# EAGLE design Regulator (EAGLE 7.1.0)
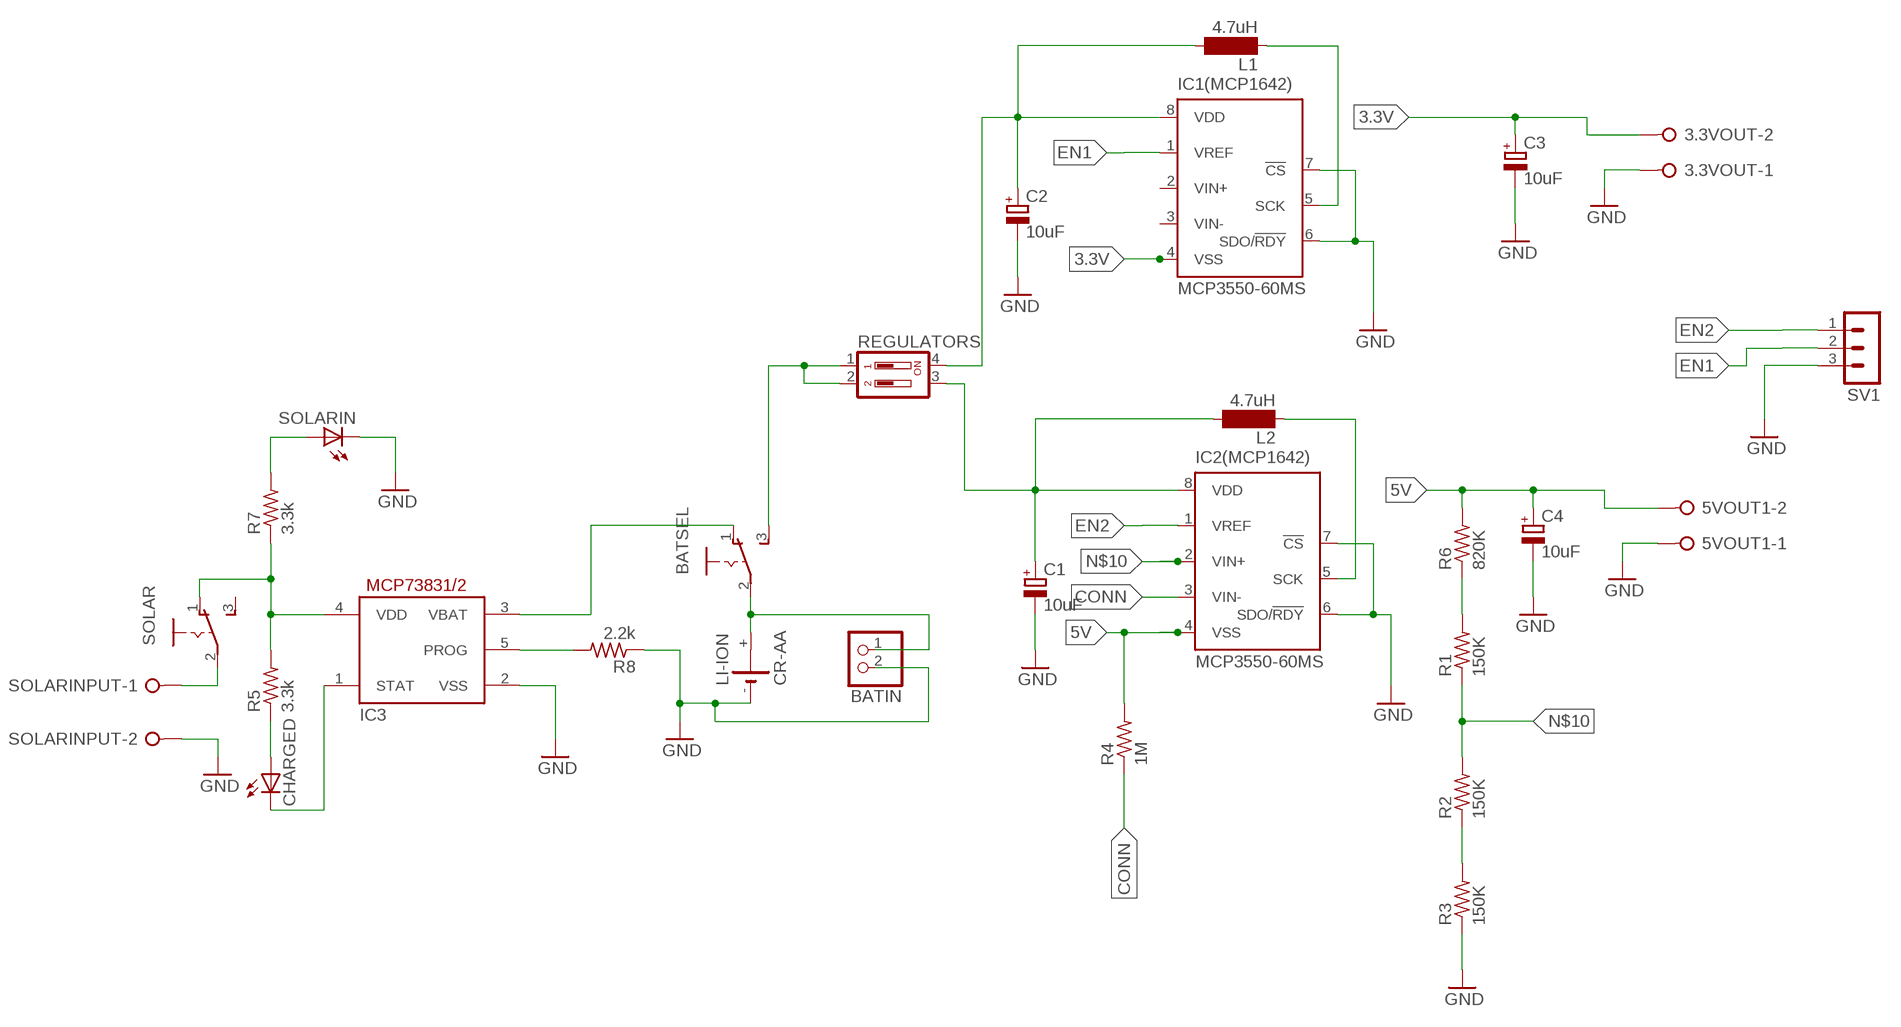
[diagram p0: schematic, sheet 1]

## Parts
3.3VOUT  W237-02P  [W237-132]
5VOUT1  W237-02P  [W237-132]
BATIN  JST_2PIN-THM  [JST-PH-2-THM]
BATSEL  255SB  [255SB]
C1  10uF  CPOL-EU140CLH-1010  [140CLH-1010]
C2  10uF  CPOL-EU140CLH-1010  [140CLH-1010]
C3  10uF  CPOL-EU140CLH-1010  [140CLH-1010]
C4  10uF  CPOL-EU140CLH-1010  [140CLH-1010]
CHARGED  LEDCHIP-LED0603  [CHIP-LED0603]
IC1(MCP1642)  MCP3550-60MS  [MSOP8]
IC2(MCP1642)  MCP3550-60MS  [MSOP8]
IC3  MCP73831/OT  [SOT23-5L]
L1  4.7uH  MS85  [MS85]
L2  4.7uH  MS85  [MS85]
LI-ION  CR-AA  [CRAA]
R1  150K  R-US_M0805  [M0805]
R2  150K  R-US_M0805  [M0805]
R3  150K  R-US_M0805  [M0805]
R4  1M  R-US_M0805  [M0805]
R5  3.3k  R-US_M3216  [M3216]
R6  820K  R-US_M0805  [M0805]
R7  3.3k  R-US_M3216  [M3216]
R8  2.2k  R-US_M3216  [M3216]
REGULATORS  DIP02YL  [DIP02YL]
SOLAR  255SB  [255SB]
SOLARIN  LEDCHIP-LED0603  [CHIP-LED0603]
SOLARINPUT  W237-02P  [W237-132]
SV1  MA03-1  [MA03-1]

## Nets
3.3V: 3.3VOUT.2 C3.+ IC1(MCP1642).4(VSS)
5V: 5VOUT1.2 C4.+ IC2(MCP1642).4(VSS) R4.2 R6.2
CONN: IC2(MCP1642).3(VIN-) R4.1
EN1: IC1(MCP1642).1(VREF) SV1.2
EN2: IC2(MCP1642).1(VREF) SV1.1
MCP1642: C2.+ IC1(MCP1642).8(VDD) L1.2 REGULATORS.4
N$2: IC1(MCP1642).5(SCK) L1.1
N$3: R1.2 R6.1
N$4: IC2(MCP1642).5(SCK) L2.1
N$6: R2.1 R3.2
N$7: C1.+ IC2(MCP1642).8(VDD) L2.2 REGULATORS.3
N$8: IC3.4(VDD) R5.2 R7.1 SOLAR.1(O)
N$10: IC2(MCP1642).2(VIN+) R1.1 R2.2
N$11: CHARGED.A R5.1
N$12: CHARGED.C IC3.1(STAT)
N$13: BATSEL.3(S) REGULATORS.1 REGULATORS.2
N$14: R7.2 SOLARIN.A
N$15: IC3.5(PROG) R8.2
N$16: BATSEL.1(O) IC3.3(VBAT)
N$19: 3.3VOUT.1 5VOUT1.1 BATIN.2 C1.- C2.- C3.- C4.- IC1(MCP1642).6(SDO/!RDY) IC1(MCP1642).7(!CS) IC2(MCP1642).6(SDO/!RDY) IC2(MCP1642).7(!CS) IC3.2(VSS) LI-ION.- R3.1 R8.1 SOLARIN.C SOLARINPUT.2 SV1.3 ; supply symbol labelled GND
N$20: SOLAR.2(P) SOLARINPUT.1
N$22: BATIN.1 BATSEL.2(P) LI-ION.+
Unconnected: IC1(MCP1642).2(VIN+) IC1(MCP1642).3(VIN-) LI-ION.+@1(+) SOLAR.3(S)

## Library data of the parts
3.3VOUT 5VOUT1 SOLARINPUT = con-wago-508:W237-02P: WAGO SREW CLAMP; OC_FARNELL: unknown; OC_NEWARK: unknown
BATIN = adafruit:JST_2PIN: JST 2-Pin Connectors of various flavors SMT-RA (S2B-PH-SM4) 4UConnector #17311 SMT (B2B-PH-SM4) THM-RA (S2B-PH) THM (B2B-PH)
BATSEL SOLAR = switch:255SB: SLIDING SWITCH Distributor Buerklin, 11G810
C1-C4 = rcl:CPOL-EU: POLARIZED CAPACITOR, European symbol
CHARGED SOLARIN = adafruit:LED: LED OSRAM: - CHIPLED LG R971, LG N971, LY N971, LG Q971, LY Q971, LO R971, LY R971 LH N974, LH R974 LS Q976, LO Q976, LY Q976 LO Q996 - Hyper CHIPLED LW Q18S LB Q993, LB Q99A, LB R99A - SideLED LS A670, LO A670, LY A670, LG A670, LP A670 LB A673, LV A673, LT A673, LW A673 LH A674 LY A675 LS A676, LA A676, LO A676, LY A676, LW A676 LS A679, LY A679, LG A679 - Hyper Micro SIDELED® LS Y876, LA Y876, LO Y876, LY Y876 LT Y87S - SmartLED LW L88C, LW L88S LB L89C, LB L89S, LG L890 LS L89K, LO L89K, LY L89K LS L896, LA L896, LO L896, LY L896 - TOPLED LS T670, LO T670, LY T670, LG T670, LP T670 LSG T670, LSP T670, LSY T670, LOP T670, LYG T670 LG T671, LOG T671, LSG T671 LB T673, LV T673, LT T673, LW T673 LH T674 LS T676, LA T676, LO T676, LY T676, LB T676, LH T676, LSB T676, LW T676 LB T67C, LV T67C, LT T67C, LS T67K, LO T67K, LY T67K, LW E67C LS E67B, LA E67B, LO E67B, LY E67B, LB E67C, LV E67C, LT E67C LW T67C LS T679, LY T679, LG T679 LS T770, LO T770, LY T770, LG T770, LP T770 LB T773, LV T773, LT T773, LW T773 LH T774 LS E675, LA E675, LY E675, LS T675 LS T776, LA T776, LO T776, LY T776, LB T776 LHGB T686 LT T68C, LB T68C - Hyper Mini TOPLED® LB M676 - Mini TOPLED Santana® LG M470 LS M47K, LO M47K, LY M47K Source: http://www.osram.convergy.de/
IC1(MCP1642) IC2(MCP1642) = microchip:MCP355*: Low-Power, Single-Channel 22-Bit Delta-Sigma ADCs Source: http://ww1.microchip.com/downloads/en/DeviceDoc/21950c.pdf; MF: MICROCHIP; MPN: MCP3550-60E/MS; OC_FARNELL: 1840933; OC_NEWARK: 69K0134
IC3 = adafruit:MCP73831: MCP73831/2 Miniature Single-Cell, Fully Integrated Li-Ion, Li-Polymer Charge Management Controllers. Nice and small simple lipoly charge controller, with adjustable current and status output (LED) http://www.ladyada.net/library/pcb/eaglelibrary.html
L1 L2 = inductor-neosid:MS85: INDUCTOR SMD power inductor; OC_FARNELL: unknown; OC_NEWARK: unknown
LI-ION = battery:CR-AA: LI BATTERY Varta CRAA-SLF
R1-R8 = adafruit:R-US_: RESISTOR, American symbol
REGULATORS = switch-dil:DIP02YL: DIL/CODE SWITCH; OC_FARNELL: unknown; OC_NEWARK: unknown
SV1 = con-lstb:MA03-1: PIN HEADER; OC_FARNELL: unknown; OC_NEWARK: unknown

## Net classes
0 default: width 0.254 mm, drill 0.508 mm, clearance 0.203 mm

## Board
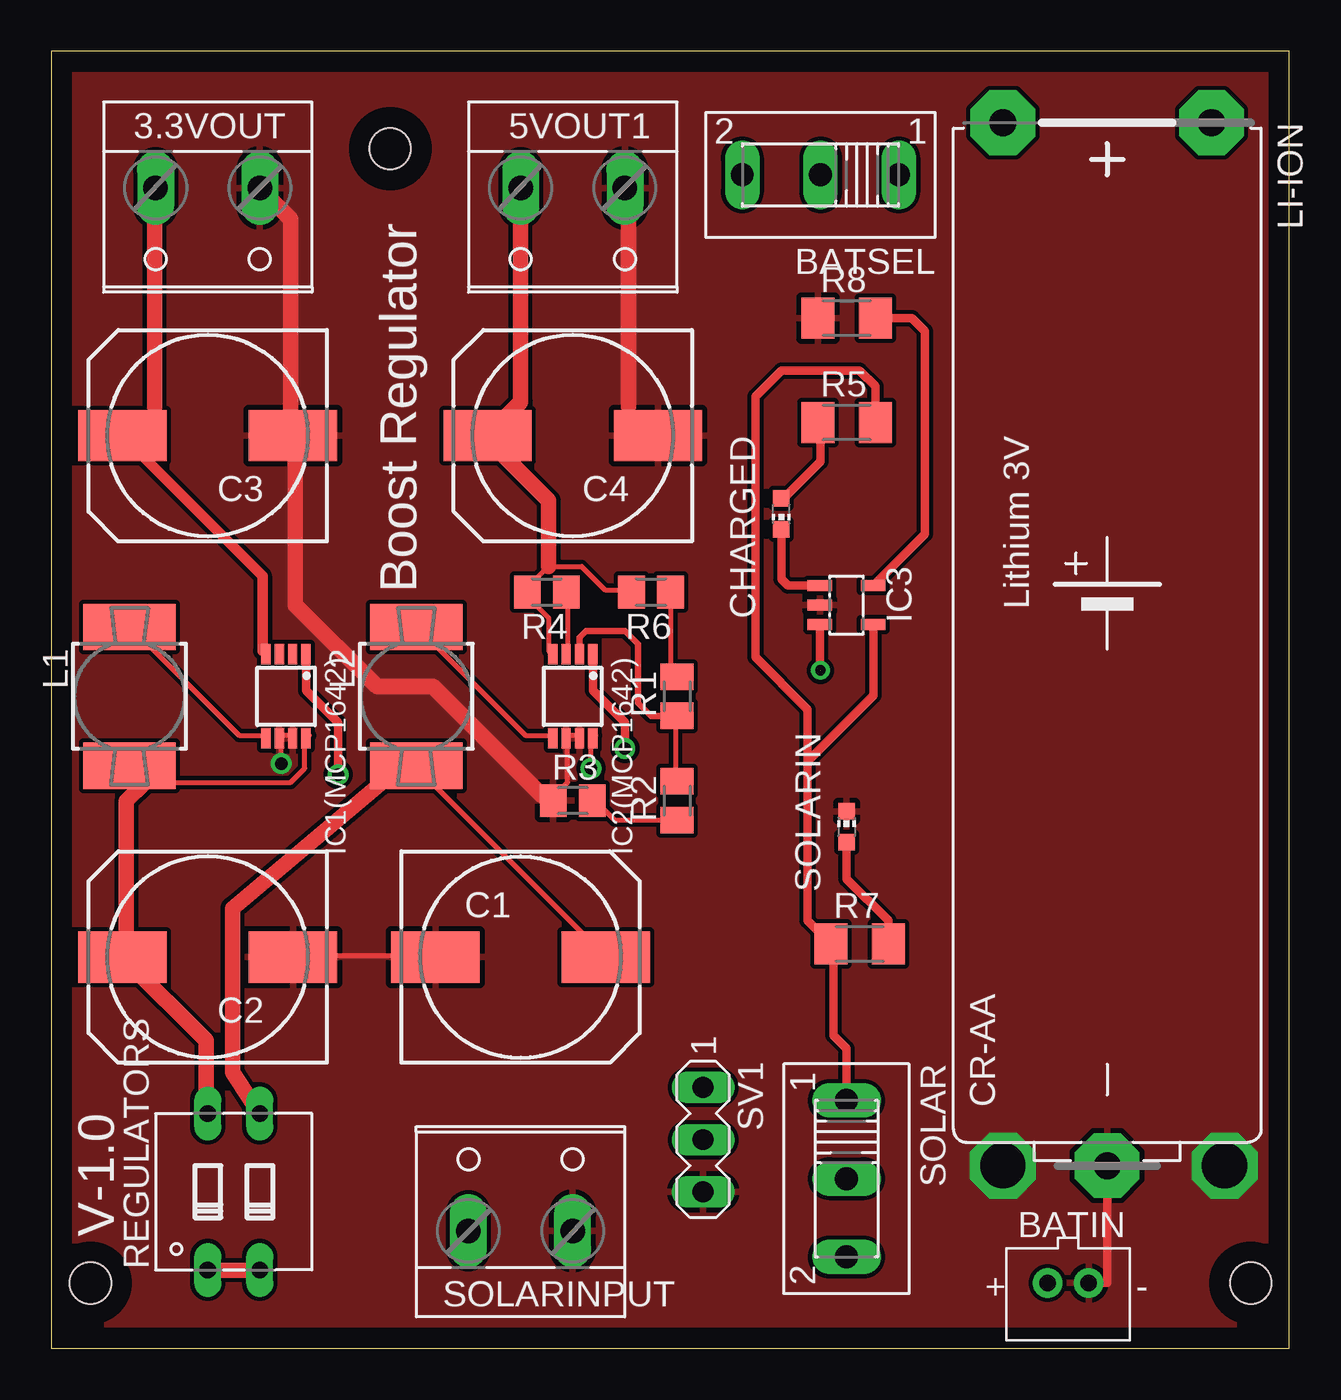
[diagram p1: board, top side]
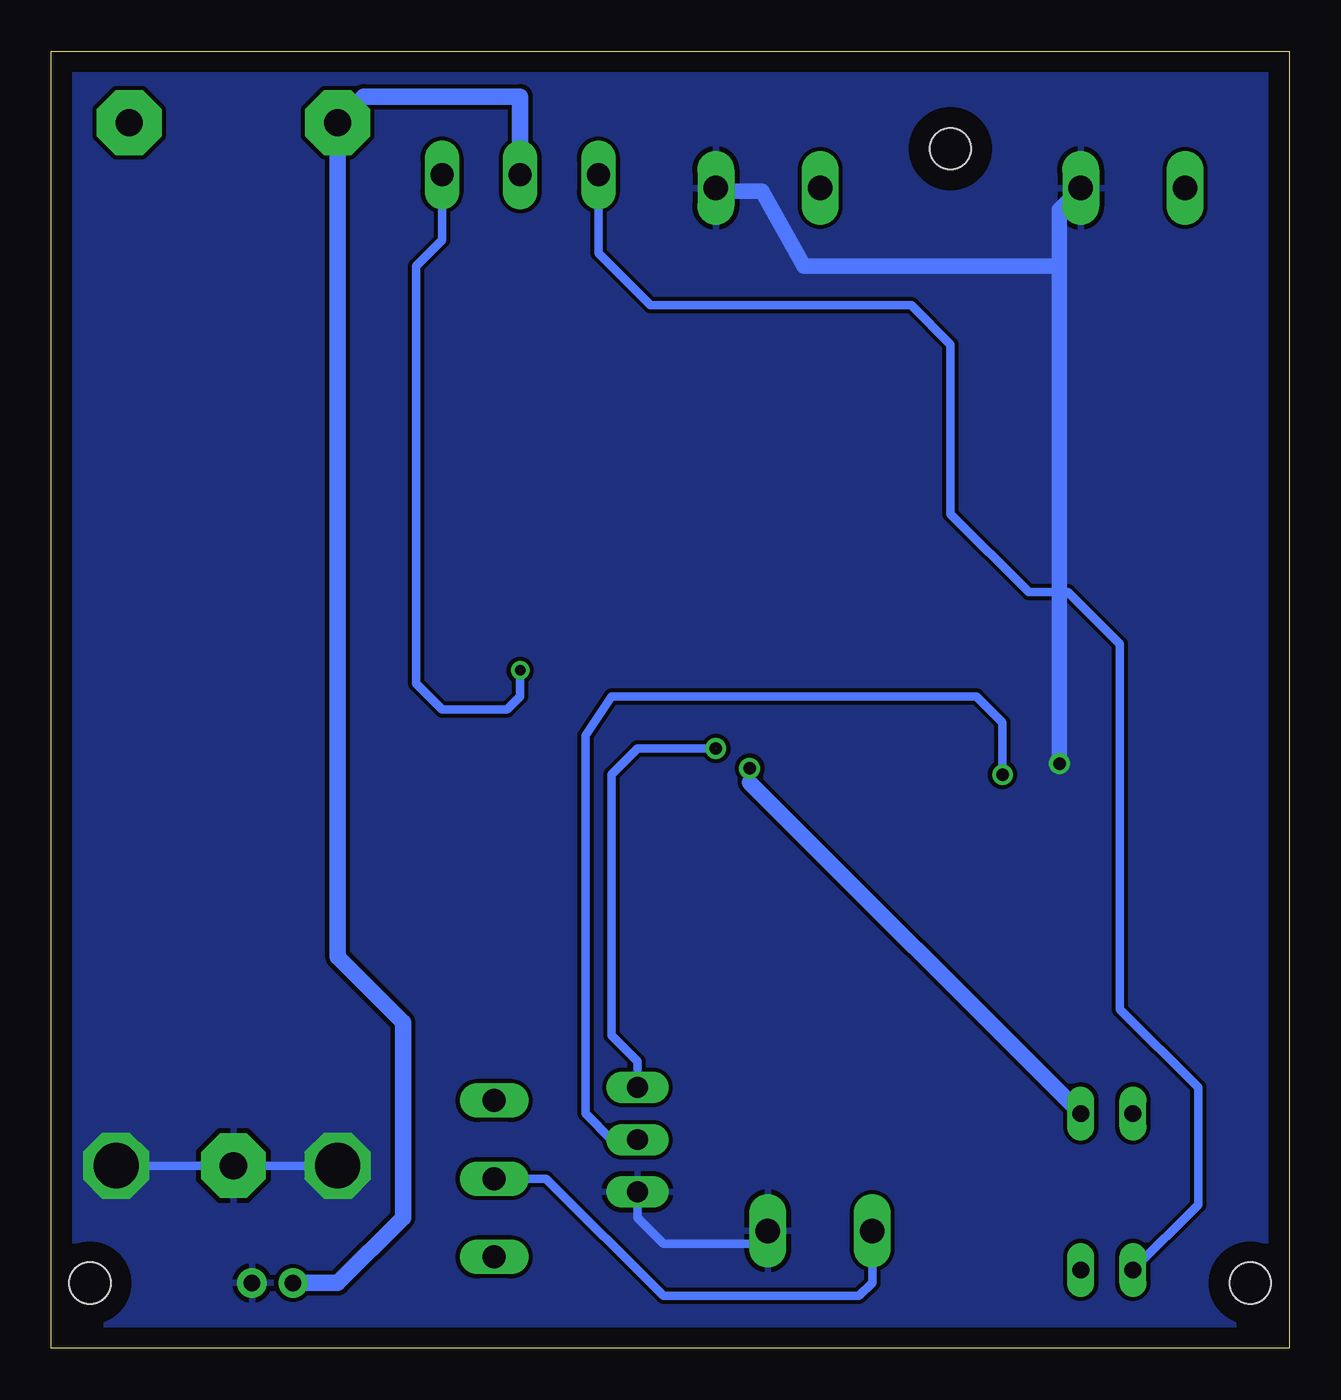
[diagram p2: board, bottom side, seen from below]

Size 60.3 x 63.17 mm. Coordinates in mm from the lower left corner, seen from the top.
Outline: 0,0 60.3,0 60.3,63.17 0,63.17 0,0
Copper layers (1*16): Top 0.035mm / dielectric 1.5mm / Bottom 0.035mm
Design rules "default": minimum track width 10mil, minimum drill 24mil, track to track 8mil, track to pad 8mil, pad to pad 8mil, via to via 8mil, smd to smd 8mil, copper to edge 40mil, drill to drill 8mil, minimum pad ring 10mil, minimum via ring 8mil, stop-mask expansion 4mil, vias tented up to drill 0mil, thermal gap 10mil
Holes 2 mm at 1.91,3.17 58.42,3.17 16.51,58.42

### Footprints (pad centres in the part's own frame; a part is rotated, then mirrored left to right if it is on the bottom)
W237-132 = drill 1.194 long: 1 -2.54,-0.635; 2 2.54,-0.635
JST-PH-2-THM = drill 0.8 pad 1.422: 1 1,0; 2 -1,0
255SB = drill 1.118 long: 1 -3.81,0; 2 0,0; 3 3.81,0
140CLH-1010 = smd 4.3 x 2.5: + 4.15,0; - -4.15,0
CHIP-LED0603 = smd 0.8 x 0.8: A 0,-0.75; C 0,0.75
MSOP8 = smd 0.45 x 1: 1 -0.975,-2.05; 2 -0.325,-2.05; 3 0.325,-2.05; 4 0.975,-2.05; 5 0.975,2.05; 6 0.325,2.05; 7 -0.325,2.05; 8 -0.975,2.05
SOT23-5L = smd 0.55 x 1.2: 1 -0.95,-1.3; 2 0,-1.3; 3 0.95,-1.3; 4 0.95,1.3; 5 -0.95,1.3
MS85 = smd 4.5 x 2.25: 1 0,-3.383; 2 0,3.383
CRAA = drill 1.321 pad 3.15 octagon: + -25.4,-5.08; +@1 -25.4,5.08; - 25.4,0
M0805 = smd 1.3 x 1.6: 1 -0.95,0; 2 0.95,0
M3216 = smd 1.6 x 2: 1 -1.4,0; 2 1.4,0
DIP02YL = drill 0.813 long: 1 -1.27,-3.81; 2 1.27,-3.81; 3 1.27,3.81; 4 -1.27,3.81
MA03-1 = drill 1.016 long: 1 -2.54,0; 2 0,0; 3 2.54,0

### Placement (x,y rotation side)
3.3VOUT  7.62,55.88 180 top
5VOUT1  25.4,55.88 180 top
BATIN  49.53,3.17 180 top
BATSEL  37.47,57.15 180 top
C1  22.86,19.05 0 top
C2  7.62,19.05 180 top
C3  7.62,44.45 180 top
C4  25.4,44.45 180 top
CHARGED  35.56,40.64 180 top
IC1(MCP1642)  11.43,31.75 180 top
IC2(MCP1642)  25.4,31.75 180 top
IC3  38.73,36.2 270 top
L1  3.81,31.75 180 top
L2  17.78,31.75 180 top
LI-ION  51.44,34.29 270 top
R1  30.48,31.75 90 top
R2  30.48,26.67 90 top
R3  25.4,26.67 0 top
R4  24.13,36.83 180 top
R5  38.73,45.09 0 top
R6  29.21,36.83 180 top
R7  39.37,19.68 0 top
R8  38.73,50.17 0 top
REGULATORS  8.89,7.62 0 top
SOLAR  38.73,8.26 270 top
SOLARIN  38.73,25.4 0 top
SOLARINPUT  22.86,6.35 0 top
SV1  31.75,10.16 270 top

### Tracks (layer width: path | path; a pad name or v marks a point on that pad's centre or on a via)
3.3V
  Top 0.254: 10.29,33.96 IC1(MCP1642).4 | 3.66,44.25 C3.+ 3.66,44.48 5.03,45.85 | 5.03,56.36 3.3VOUT.2
  Top 0.508: 10.29,33.96 10.29,37.62 3.66,44.25
  Top 0.762: 5.03,45.85 5.03,56.36
5V
  Top 0.254: IC2(MCP1642).4 24.23,33.96 24.23,35.56 23.09,36.7 R4.2 23.09,36.93 24.23,38.08 25.83,38.08 26.98,36.93 28.12,36.93 R6.2 | 21.26,44.48 C4.+ 21.26,44.25
  Top 0.762: 5VOUT1.2 22.86,46.08 21.26,44.48 | 24.23,38.08 24.23,41.28 21.26,44.25
CONN
  Top 0.254: IC2(MCP1642).3 25.15,33.96 25.15,36.7 R4.1
EN1  (1 unrouted)
  Top 0.406: IC1(MCP1642).1 12.4,32.05 13.97,30.48 13.97,27.94
  Bottom 0.406: SV1.2 33.02,10.16 34.29,11.43 34.29,29.84 33.02,31.75 15.24,31.75 13.97,30.48 13.97,27.94
EN2  (1 unrouted)
  Top 0.406: IC2(MCP1642).1 26.38,32.05 27.94,30.48 27.94,29.21
  Bottom 0.406: SV1.1 31.75,13.97 33.02,15.24 33.02,27.94 31.75,29.21 27.94,29.21
MCP1642
  Top 0.254: 7.54,11.56 REGULATORS.4 | 3.66,18.87 C2.+ 3.66,19.1 | 12.57,29.84 IC1(MCP1642).8 12.34,29.62 12.34,28.25 11.66,27.56 4.57,27.56 3.89,28.25 L1.2
  Top 0.762: 7.54,11.56 7.54,14.99 3.66,18.87 | 3.66,19.1 3.66,26.64 4.57,27.56 L1.2
N$2
  Top 0.254: IC1(MCP1642).5 10.29,29.84 9.14,29.84 3.89,35.1 L1.1
N$3
  Top 0.254: R6.1 30.18,36.7 30.18,33.05 30.4,32.82 R1.2
N$4
  Top 0.254: IC2(MCP1642).5 24.23,29.84 23.09,29.84 17.83,35.1 L2.1
N$5  (via drill 0.6)
  other vias: 13.97,27.94
N$6
  Top 0.254: R2.1 30.4,25.73 27.43,25.73 26.52,26.64 R3.2
N$7  (via drill 0.61)
  Top 0.254: C1.+ 26.98,19.1 17.83,28.25 L2.2 17.6,28.25 16.92,28.25 | 26.52,29.84 IC2(MCP1642).8 26.29,29.62 v26.29,28.25 | 10.06,11.56 REGULATORS.3
  Top 0.762: 16.92,28.25 8.83,21.43 8.83,13.42 10.06,11.56
  Bottom 0.254: 26.29,27.56 v26.29,28.25
  Bottom 0.762: REGULATORS.3 26.29,27.56
N$8
  Top 0.406: 38.1,19.82 R7.1 | IC3.4 40.03,31.78 36.83,28.57 | 36.83,28.57 36.83,20.82 R7.1 | R5.2 40.13,46.86 39.37,47.62 35.56,47.62 34.29,46.36 34.29,33.66 36.83,31.11 36.83,28.57 | SOLAR.1 38.73,14.61 38.1,15.24 38.1,19.55 R7.1
N$9  (via drill 0.6)
  other vias: 27.94,29.21
N$10
  Top 0.254: R2.2 30.4,27.79 30.4,30.76 R1.1
  Top 0.305: IC2(MCP1642).2 25.73,34.62 26.04,34.93 27.94,34.93 28.57,34.29 28.57,31.43 29.21,30.8 R1.1
N$11
  Top 0.406: CHARGED.A 35.67,41.39 37.47,43.18 37.47,44.96 R5.1
N$12
  Top 0.406: IC3.1 35.88,37.15 35.56,37.47 CHARGED.C
N$13
  Top 0.254: 7.77,3.79 REGULATORS.1 | 10.06,3.79 REGULATORS.2 10.29,4.01
  Top 0.762: 10.06,3.79 7.77,3.79
  Bottom 0.406: BATSEL.3 33.66,53.34 31.11,50.8 18.41,50.8 16.51,48.9 16.51,40.64 12.7,36.83 10.79,36.83 8.26,34.29 8.26,16.51 4.45,12.7 4.45,6.98 REGULATORS.1
N$14
  Top 0.406: R7.2 40.77,20.82 38.73,22.86 SOLARIN.A
N$15
  Top 0.406: R8.2 41.91,50.17 42.55,49.53 42.55,39.66 IC3.5
N$16  (1 unrouted)
  Top 0.406: IC3.3 37.44,33.05 37.47,33.02
  Bottom 0.406: BATSEL.1 41.27,53.98 42.55,52.71 42.55,32.38 41.27,31.11 38.1,31.11 37.47,31.75 37.47,33.02
N$18  (via drill 0.5)
  other vias: 37.47,33.02
N$19  (via drill 0.61, 2.2)
  Top 0.254: IC2(MCP1642).7 25.6,29.84 25.15,29.84 IC2(MCP1642).6 25.15,29.62 25.15,27.56 24.46,26.87 R3.1 24.23,26.87 23.95,26.87 | C2.- 11.89,19.1 18.52,19.1 C1.- | 28.12,45.85 29.49,44.48 C4.- | 28.12,56.36 5VOUT1.1 | IC1(MCP1642).7 11.66,29.84 11.2,29.84 IC1(MCP1642).6 11.2,29.62 v11.2,28.47 | 11.66,44.48 C3.- 11.89,44.25 | 10.29,56.36 3.3VOUT.1
  Top 0.406: BATIN.2 51.44,3.17 LI-ION.-
  Top 0.762: 28.12,45.85 28.12,56.36 | 11.66,44.48 11.66,54.99 10.29,56.36 | 23.95,26.87 18.59,32.23 15.86,32.23 11.89,36.21 11.89,44.25
  Bottom 0.254: 10.29,56.36 3.3VOUT.1 | 27.89,56.36 5VOUT1.1
  Bottom 0.406: SV1.3 31.75,6.35 30.48,5.08 26.04,5.08 SOLARINPUT.2 | v46.35,8.89 LI-ION.- v57.15,8.89
  Bottom 0.762: 11.2,52.72 11.2,55.45 10.29,56.36 | 11.2,52.72 v11.2,28.47 | 27.89,56.36 25.69,56.36 23.64,52.72 11.2,52.72
  pour Top: -2.54,63.5 62.23,63.5 62.23,-1.27 -2.54,-1.27
  pour Bottom: -1.27,63.5 60.33,63.5 60.33,0 -1.27,0
N$20
  Bottom 0.406: SOLAR.2 36.2,8.26 30.48,2.54 20.95,2.54 20.32,3.17 SOLARINPUT.1
N$22
  Bottom 0.813: BATIN.1 46.35,3.17 43.18,6.35 43.18,15.88 46.35,19.05 LI-ION.+ 45.09,60.96 37.47,60.96 BATSEL.2

### Text on the board
tNames: Boost Regulator | V-1.0